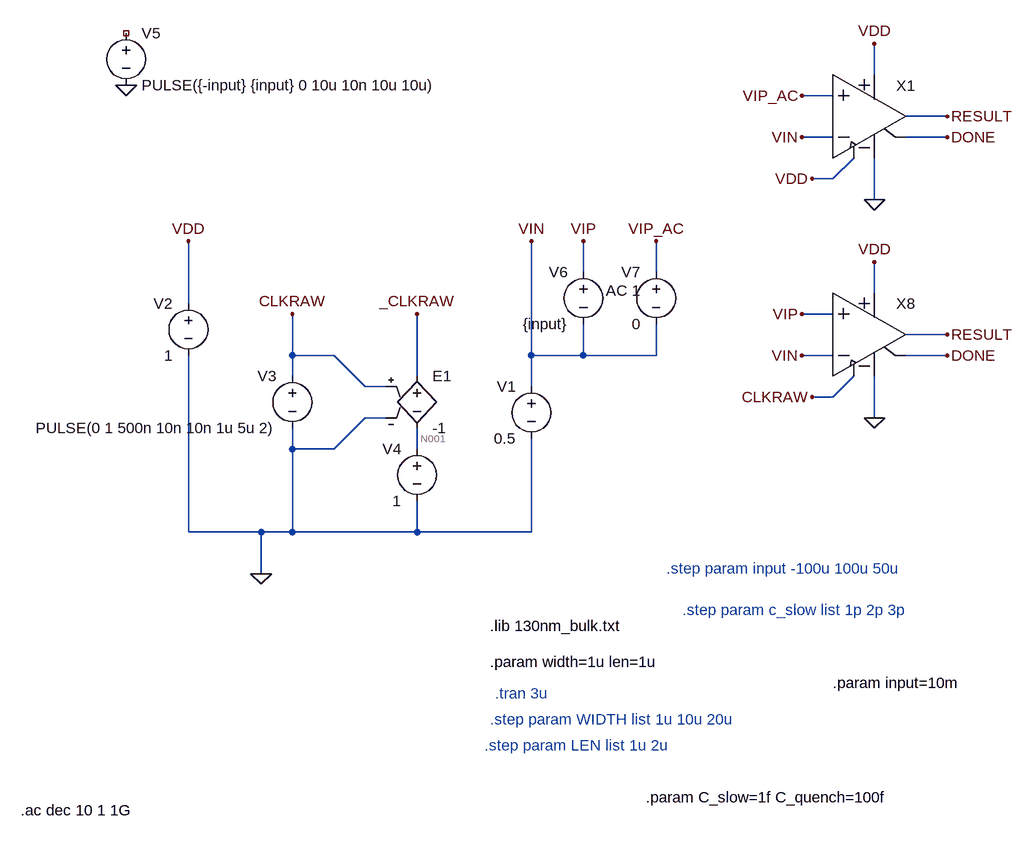
[diagram p0: schematic tb_comparator.asc]
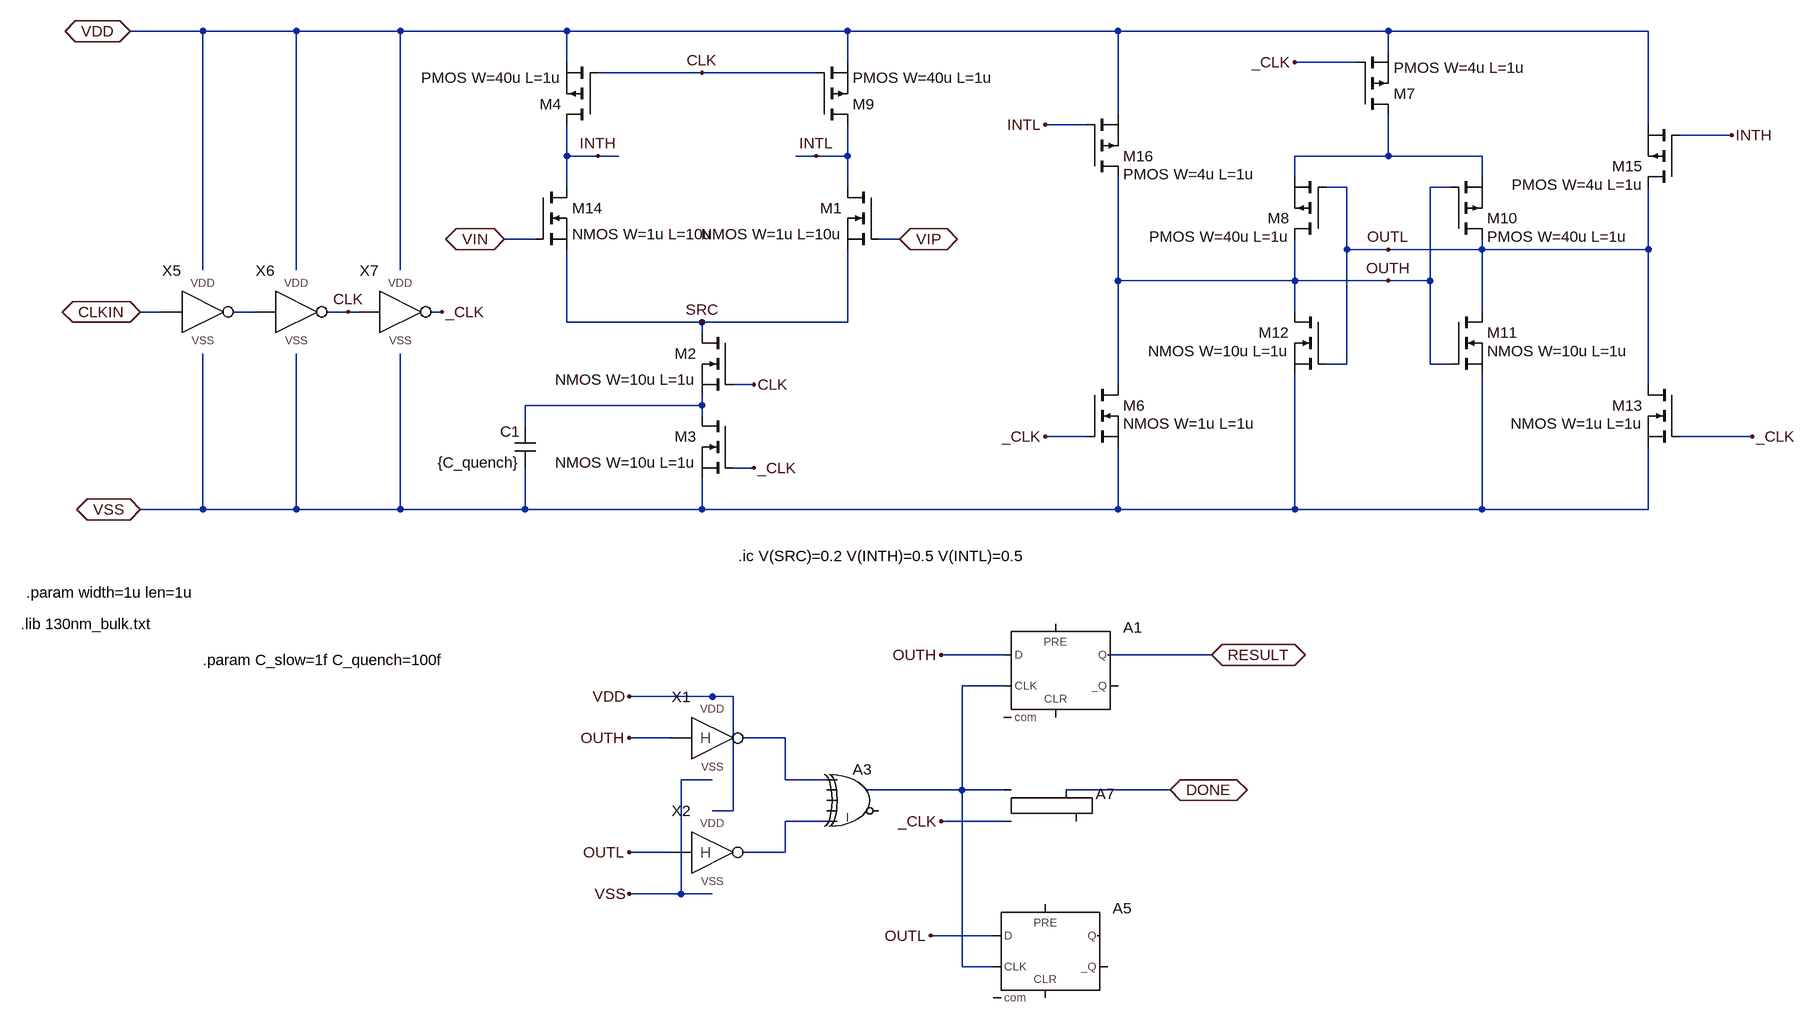
[diagram p1: sub-circuit dyn_comparator.asc]
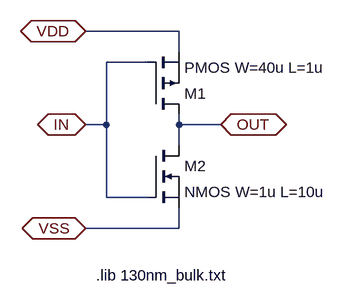
[diagram p2: sub-circuit skewh_inverter.asc]
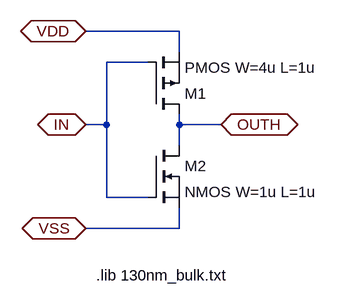
[diagram p3: sub-circuit skewm_inverter.asc]
tb_comparator.asc, the LTspice schematic file:
Version 4
SHEET 1 1376 1188
WIRE -352 -656 -352 -704
WIRE -416 -624 -464 -624
WIRE -240 -592 -304 -592
WIRE -416 -560 -464 -560
WIRE -240 -560 -304 -560
WIRE -416 -496 -384 -528
WIRE -416 -496 -448 -496
WIRE -352 -464 -352 -528
WIRE -800 -352 -800 -400
WIRE -688 -352 -688 -400
WIRE -352 -320 -352 -368
WIRE -1408 -304 -1408 -400
WIRE -416 -288 -464 -288
WIRE -240 -256 -304 -256
WIRE -1248 -224 -1248 -288
WIRE -1184 -224 -1248 -224
WIRE -880 -224 -880 -400
WIRE -800 -224 -800 -272
WIRE -800 -224 -880 -224
WIRE -688 -224 -688 -272
WIRE -688 -224 -800 -224
WIRE -416 -224 -464 -224
WIRE -240 -224 -304 -224
WIRE -1248 -192 -1248 -224
WIRE -1056 -192 -1056 -288
WIRE -1136 -176 -1184 -224
WIRE -1104 -176 -1136 -176
WIRE -880 -176 -880 -224
WIRE -416 -160 -384 -192
WIRE -416 -160 -448 -160
WIRE -1104 -128 -1136 -128
WIRE -352 -128 -352 -192
WIRE -1248 -80 -1248 -112
WIRE -1184 -80 -1136 -128
WIRE -1184 -80 -1248 -80
WIRE -1056 -80 -1056 -112
WIRE -1408 48 -1408 -224
WIRE -1296 48 -1408 48
WIRE -1248 48 -1248 -80
WIRE -1248 48 -1296 48
WIRE -1056 48 -1056 0
WIRE -1056 48 -1248 48
WIRE -880 48 -880 -96
WIRE -880 48 -1056 48
WIRE -1296 112 -1296 48
FLAG -352 -368 VDD
FLAG -464 -224 VIN
FLAG -1296 112 0
FLAG -880 -400 VIN
FLAG -1408 -400 VDD
FLAG -464 -288 VIP
FLAG -1248 -288 CLKRAW
FLAG -1056 -288 _CLKRAW
FLAG -800 -400 VIP
FLAG -1504 -640 0
FLAG -448 -160 CLKRAW
FLAG -352 -128 0
FLAG -240 -256 RESULT
FLAG -240 -224 DONE
FLAG -352 -704 VDD
FLAG -464 -560 VIN
FLAG -464 -624 VIP_AC
FLAG -448 -496 VDD
FLAG -352 -464 0
FLAG -240 -592 RESULT
FLAG -240 -560 DONE
FLAG -688 -400 VIP_AC
SYMBOL voltage -880 -192 M0
WINDOW 123 0 0 Left 0
WINDOW 39 0 0 Left 0
SYMATTR InstName V1
SYMATTR Value 0.5
SYMBOL voltage -1408 -320 M0
WINDOW 123 0 0 Left 0
WINDOW 39 0 0 Left 0
SYMATTR InstName V2
SYMATTR Value 1
SYMBOL voltage -1248 -208 M0
WINDOW 123 0 0 Left 0
WINDOW 39 0 0 Left 0
SYMATTR InstName V3
SYMATTR Value PULSE(0 1 500n 10n 10n 1u 5u 2)
SYMBOL e -1056 -208 R0
SYMATTR InstName E1
SYMATTR Value -1
SYMBOL voltage -1056 -96 M0
WINDOW 123 0 0 Left 0
WINDOW 39 0 0 Left 0
SYMATTR InstName V4
SYMATTR Value 1
SYMBOL voltage -1504 -736 R0
WINDOW 123 0 0 Left 0
WINDOW 39 0 0 Left 0
SYMATTR InstName V5
SYMATTR Value PULSE({-input} {input} 0 10u 10n 10u 10u)
SYMBOL voltage -800 -368 M0
WINDOW 123 0 0 Left 0
WINDOW 39 0 0 Left 0
SYMATTR InstName V6
SYMATTR Value {input}
SYMBOL dyn_comparator -368 -256 R0
SYMATTR InstName X8
SYMBOL dyn_comparator -368 -592 R0
SYMATTR InstName X1
SYMBOL voltage -688 -368 M0
WINDOW 123 24 44 Left 2
WINDOW 39 0 0 Left 0
SYMATTR Value2 AC 1
SYMATTR InstName V7
SYMATTR Value 0
TEXT -944 192 Left 2 !.lib 130nm_bulk.txt
TEXT -936 296 Left 2 ;.tran 3u
TEXT -944 248 Left 2 !.param width=1u len=1u
TEXT -944 336 Left 2 ;.step param WIDTH list 1u 10u 20u
TEXT -952 376 Left 2 ;.step param LEN list 1u 2u
TEXT -416 280 Left 2 !.param input=10m
TEXT -672 104 Left 2 ;.step param input -100u 100u 50u
TEXT -648 168 Left 2 ;.step param c_slow list 1p 2p 3p
TEXT -704 456 Left 2 !.param C_slow=1f C_quench=100f
TEXT -1666 476 Left 2 !.ac dec 10 1 1G

dyn_comparator.asc, the sub-circuit schematic file:
Version 4
SHEET 1 3000 1348
WIRE -368 -352 -480 -352
WIRE -224 -352 -368 -352
WIRE -64 -352 -224 -352
WIRE 192 -352 -64 -352
WIRE 624 -352 192 -352
WIRE 1040 -352 624 -352
WIRE 1456 -352 1040 -352
WIRE 1856 -352 1456 -352
WIRE 1456 -320 1456 -352
WIRE 192 -304 192 -352
WIRE 624 -304 624 -352
WIRE 1408 -304 1312 -304
WIRE 400 -288 240 -288
WIRE 576 -288 400 -288
WIRE 1040 -224 1040 -352
WIRE 992 -208 928 -208
WIRE 1856 -208 1856 -352
WIRE 1984 -192 1904 -192
WIRE 192 -160 192 -208
WIRE 240 -160 192 -160
WIRE 272 -160 240 -160
WIRE 576 -160 544 -160
WIRE 624 -160 624 -208
WIRE 624 -160 576 -160
WIRE 1456 -160 1456 -224
WIRE 1456 -160 1312 -160
WIRE 1600 -160 1456 -160
WIRE 1312 -128 1312 -160
WIRE 1600 -128 1600 -160
WIRE 192 -112 192 -160
WIRE 624 -112 624 -160
WIRE 1392 -112 1360 -112
WIRE 1552 -112 1520 -112
WIRE 144 -32 96 -32
WIRE 704 -32 672 -32
WIRE 1392 -16 1392 -112
WIRE 1456 -16 1392 -16
WIRE 1600 -16 1600 -32
WIRE 1600 -16 1456 -16
WIRE 1856 -16 1856 -112
WIRE 1856 -16 1600 -16
WIRE -368 16 -368 -352
WIRE -224 16 -224 -352
WIRE -64 16 -64 -352
WIRE 1040 32 1040 -128
WIRE 1312 32 1312 -32
WIRE 1312 32 1040 32
WIRE 1456 32 1312 32
WIRE 1520 32 1520 -112
WIRE 1520 32 1456 32
WIRE -432 80 -464 80
WIRE -288 80 -320 80
WIRE -144 80 -176 80
WIRE -128 80 -144 80
WIRE 0 80 -16 80
WIRE 1312 80 1312 32
WIRE 1600 80 1600 -16
WIRE 192 96 192 -16
WIRE 400 96 192 96
WIRE 624 96 624 -16
WIRE 624 96 400 96
WIRE 400 112 400 96
WIRE 1392 160 1392 -16
WIRE 1392 160 1360 160
WIRE 1520 160 1520 32
WIRE 1552 160 1520 160
WIRE 480 192 448 192
WIRE 1040 192 1040 32
WIRE 1856 192 1856 -16
WIRE 400 224 400 208
WIRE 400 224 128 224
WIRE 400 240 400 224
WIRE 128 256 128 224
WIRE 992 272 928 272
WIRE 2016 272 1904 272
WIRE 480 320 448 320
WIRE -368 384 -368 144
WIRE -368 384 -464 384
WIRE -224 384 -224 144
WIRE -224 384 -368 384
WIRE -64 384 -64 144
WIRE -64 384 -224 384
WIRE 128 384 128 320
WIRE 128 384 -64 384
WIRE 400 384 400 336
WIRE 400 384 128 384
WIRE 1040 384 1040 288
WIRE 1040 384 400 384
WIRE 1312 384 1312 176
WIRE 1312 384 1040 384
WIRE 1600 384 1600 176
WIRE 1600 384 1312 384
WIRE 1856 384 1856 288
WIRE 1856 384 1600 384
WIRE 864 608 768 608
WIRE 1184 608 1024 608
WIRE 864 656 800 656
WIRE 416 672 288 672
WIRE 448 672 416 672
WIRE 352 736 288 736
WIRE 528 736 464 736
WIRE 416 800 368 800
WIRE 528 800 528 736
WIRE 592 800 528 800
WIRE 800 816 800 656
WIRE 800 816 656 816
WIRE 864 816 800 816
WIRE 1120 816 960 816
WIRE 448 848 448 672
WIRE 448 848 416 848
WIRE 592 864 528 864
WIRE 864 864 768 864
WIRE 352 912 288 912
WIRE 528 912 528 864
WIRE 528 912 464 912
WIRE 368 976 368 800
WIRE 368 976 288 976
WIRE 416 976 368 976
WIRE 848 1040 752 1040
WIRE 800 1088 800 816
WIRE 848 1088 800 1088
FLAG 240 -160 INTH
FLAG 96 -32 VIN
IOPIN 96 -32 BiDir
FLAG 576 -160 INTL
FLAG 704 -32 VIP
IOPIN 704 -32 BiDir
FLAG 480 192 CLK
FLAG 400 -288 CLK
FLAG 928 -208 INTL
FLAG 2016 272 _CLK
FLAG 1984 -192 INTH
FLAG 1456 -16 OUTL
FLAG 1456 32 OUTH
FLAG 768 608 OUTH
FLAG 1184 608 RESULT
IOPIN 1184 608 BiDir
FLAG 768 864 _CLK
FLAG 288 736 OUTH
FLAG 1120 816 DONE
IOPIN 1120 816 BiDir
FLAG 288 912 OUTL
FLAG 288 672 VDD
FLAG 928 272 _CLK
FLAG 1312 -304 _CLK
FLAG -464 80 CLKIN
IOPIN -464 80 BiDir
FLAG -144 80 CLK
FLAG 752 1040 OUTL
FLAG 0 80 _CLK
FLAG 480 320 _CLK
FLAG -464 384 VSS
IOPIN -464 384 BiDir
FLAG -480 -352 VDD
IOPIN -480 -352 BiDir
FLAG 288 976 VSS
FLAG 400 96 SRC
SYMBOL pmos 240 -208 R180
SYMATTR InstName M4
SYMATTR Value PMOS W=40u L=1u
SYMBOL nmos 448 112 M0
SYMATTR InstName M2
SYMATTR Value NMOS W=10u L=1u
SYMBOL pmos 1360 -32 R180
WINDOW 3 56 4 Left 2
SYMATTR Value PMOS W=40u L=1u
SYMATTR InstName M8
SYMBOL pmos 1552 -32 M180
WINDOW 3 56 4 Left 2
SYMATTR Value PMOS W=40u L=1u
SYMATTR InstName M10
SYMBOL nmos 1552 80 R0
WINDOW 3 56 60 Left 2
SYMATTR Value NMOS W=10u L=1u
SYMATTR InstName M11
SYMBOL nmos 1360 80 M0
WINDOW 3 56 60 Left 2
SYMATTR Value NMOS W=10u L=1u
SYMATTR InstName M12
SYMBOL nmos 1904 192 M0
WINDOW 3 56 60 Left 2
SYMATTR Value NMOS W=1u L=1u
SYMATTR InstName M13
SYMBOL pmos 1904 -112 R180
WINDOW 3 56 4 Left 2
SYMATTR Value PMOS W=4u L=1u
SYMATTR InstName M15
SYMBOL pmos 992 -128 M180
WINDOW 3 56 4 Left 2
SYMATTR Value PMOS W=4u L=1u
SYMATTR InstName M16
SYMBOL Digital\\dflop 944 560 R0
SYMATTR InstName A1
SYMBOL Digital\\xor 640 768 R0
SYMATTR InstName A3
SYMBOL nmos 992 192 R0
WINDOW 3 56 60 Left 2
SYMATTR Value NMOS W=1u L=1u
SYMATTR InstName M6
SYMBOL pmos 1408 -224 M180
SYMATTR InstName M7
SYMATTR Value PMOS W=4u L=1u
SYMBOL skewH_inverter 416 720 R0
SYMATTR InstName X1
SYMBOL skewH_inverter 416 896 R0
SYMATTR InstName X2
SYMBOL Digital\\srflop 912 768 R0
SYMATTR InstName A7
SYMBOL pmos 576 -208 M180
SYMATTR InstName M9
SYMATTR Value PMOS W=40u L=1u
SYMBOL nmos 144 -112 R0
SYMATTR InstName M14
SYMATTR Value NMOS W=1u L=10u
SYMBOL nmos 672 -112 M0
SYMATTR InstName M1
SYMATTR Value NMOS W=1u L=10u
SYMBOL skewM_inverter -368 64 R0
SYMATTR InstName X5
SYMBOL skewM_inverter -224 64 R0
SYMATTR InstName X6
SYMBOL Digital\\dflop 928 992 R0
SYMATTR InstName A5
SYMBOL skewM_inverter -64 64 R0
SYMATTR InstName X7
SYMBOL cap 144 256 M0
SYMATTR InstName C1
SYMATTR Value {C_quench}
SYMBOL nmos 448 240 M0
SYMATTR InstName M3
SYMATTR Value NMOS W=10u L=1u
TEXT -648 560 Left 2 !.lib 130nm_bulk.txt
TEXT -640 512 Left 2 !.param width=1u len=1u
TEXT -368 616 Left 2 !.param C_slow=1f C_quench=100f
TEXT 456 456 Left 2 !.ic V(SRC)=0.2 V(INTH)=0.5 V(INTL)=0.5

skewh_inverter.asc, the sub-circuit schematic file:
Version 4
SHEET 1 880 680
WIRE 128 -48 -16 -48
WIRE 128 -16 128 -48
WIRE 80 0 16 0
WIRE 16 96 16 0
WIRE 16 96 -16 96
WIRE 128 96 128 80
WIRE 192 96 128 96
WIRE 128 128 128 96
WIRE 16 208 16 96
WIRE 80 208 16 208
WIRE 128 256 128 224
WIRE 128 256 -16 256
FLAG 192 96 OUT
IOPIN 192 96 BiDir
FLAG -16 -48 VDD
IOPIN -16 -48 BiDir
FLAG -16 96 IN
IOPIN -16 96 BiDir
FLAG -16 256 VSS
IOPIN -16 256 BiDir
SYMBOL pmos 80 80 M180
SYMATTR InstName M1
SYMATTR Value PMOS W=40u L=1u
SYMBOL nmos 80 128 R0
SYMATTR InstName M2
SYMATTR Value NMOS W=1u L=10u
TEXT 0 328 Left 2 !.lib 130nm_bulk.txt

skewm_inverter.asc, the sub-circuit schematic file:
Version 4
SHEET 1 880 980
WIRE 320 -128 176 -128
WIRE 320 -96 320 -128
WIRE 272 -80 208 -80
WIRE 208 16 208 -80
WIRE 208 16 176 16
WIRE 320 16 320 0
WIRE 384 16 320 16
WIRE 320 48 320 16
WIRE 208 128 208 16
WIRE 272 128 208 128
WIRE 320 176 320 144
WIRE 320 176 176 176
FLAG 384 16 OUTH
IOPIN 384 16 BiDir
FLAG 176 -128 VDD
IOPIN 176 -128 BiDir
FLAG 176 16 IN
IOPIN 176 16 BiDir
FLAG 176 176 VSS
IOPIN 176 176 BiDir
SYMBOL pmos 272 0 M180
SYMATTR InstName M1
SYMATTR Value PMOS W=4u L=1u
SYMBOL nmos 272 48 R0
SYMATTR InstName M2
SYMATTR Value NMOS W=1u L=1u
TEXT 192 248 Left 2 !.lib 130nm_bulk.txt

The netlist it stands for:
* tb_comparator.asc
V1 VIN 0 0.5
V2 VDD 0 1
V3 CLKRAW 0 PULSE(0 1 500n 10n 10n 1u 5u 2)
E1 _CLKRAW N001 CLKRAW 0 -1
V4 N001 0 1
V5 NC_01 0 PULSE({-input} {input} 0 10u 10n 10u 10u)
V6 VIP VIN {input}
XX8 CLKRAW RESULT VDD VIN VIP 0 DONE dyn_comparator
XX1 VDD RESULT VDD VIN VIP_AC 0 DONE dyn_comparator
V7 VIP_AC VIN 0 AC 1

* block symbol definitions
.subckt dyn_comparator CLKIN RESULT VDD VIN VIP VSS DONE
M4 INTH CLK VDD VDD PMOS W=40u L=1u
M2 SRC CLK N003 N003 NMOS W=10u L=1u
M8 OUTH OUTL N001 N001 PMOS W=40u L=1u
M10 OUTL OUTH N001 N001 PMOS W=40u L=1u
M11 OUTL OUTH VSS VSS NMOS W=10u L=1u
M12 OUTH OUTL VSS VSS NMOS W=10u L=1u
M13 OUTL _CLK VSS VSS NMOS W=1u L=1u
M15 OUTL INTH VDD VDD PMOS W=4u L=1u
M16 OUTH INTL VDD VDD PMOS W=4u L=1u
A1 OUTH 0 N004 0 0 0 RESULT 0 DFLOP
A3 N005 0 0 0 N006 0 N004 0 XOR
M6 OUTH _CLK VSS VSS NMOS W=1u L=1u
M7 N001 _CLK VDD VDD PMOS W=4u L=1u
XX1 OUTH N005 VDD VSS skewh_inverter
XX2 OUTL N006 VDD VSS skewh_inverter
A7 N004 _CLK 0 0 0 0 DONE 0 SRFLOP
M9 INTL CLK VDD VDD PMOS W=40u L=1u
M14 INTH VIN SRC SRC NMOS W=1u L=10u
M1 INTL VIP SRC SRC NMOS W=1u L=10u
XX5 CLKIN N002 VDD VSS skewm_inverter
XX6 N002 CLK VDD VSS skewm_inverter
A5 OUTL 0 N004 0 0 0 0 0 DFLOP
XX7 CLK _CLK VDD VSS skewm_inverter
C1 N003 VSS {C_quench}
M3 N003 _CLK VSS VSS NMOS W=10u L=1u
.lib 130nm_bulk.txt
.param width=1u len=1u
.param C_slow=1f C_quench=100f
.ic V(SRC)=0.2 V(INTH)=0.5 V(INTL)=0.5
.ends dyn_comparator

.subckt skewh_inverter IN OUT VDD VSS
M1 OUT IN VDD VDD PMOS W=40u L=1u
M2 OUT IN VSS VSS NMOS W=1u L=10u
.lib 130nm_bulk.txt
.ends skewh_inverter

.subckt skewm_inverter IN OUTH VDD VSS
M1 OUTH IN VDD VDD PMOS W=4u L=1u
M2 OUTH IN VSS VSS NMOS W=1u L=1u
.lib 130nm_bulk.txt
.ends skewm_inverter

.model NMOS NMOS
.model PMOS PMOS
.lib standard.mos
.lib 130nm_bulk.txt
* .tran 3u
.param width=1u len=1u
* .step param WIDTH list 1u 10u 20u
* .step param LEN list 1u 2u
.param input=10m
* .step param input -100u 100u 50u
* .step param c_slow list 1p 2p 3p
.param C_slow=1f C_quench=100f
.ac dec 10 1 1G
.backanno
.end

* Results of the author's LTspice run, read from the files saved beside the schematic
* Operating Point, zero values left out:
*   V(vin) = 500 mV
*   V(vdd) = 1 V
*   V(_clkraw) = 1 V
*   V(n001) = 1 V
*   V(vip) = 510 mV
*   V(vip_ac) = 500 mV
*   I(V7) = -4.225 pA
*   I(V6) = -6.182 pA
*   I(V3) = 203.2 pA
*   I(V2) = -1.212 mA
*   I(V1) = -18.86 pA
*   Ix(x8:CLKIN) = -203.2 pA
*   Ix(x8:VDD) = 1.167 mA
*   Ix(x8:VIN) = 4.225 pA
*   Ix(x8:VIP) = 6.182 pA
*   Ix(x8:VSS) = -12.81 µA
*   Ix(x1:CLKIN) = 9.896 nA
*   Ix(x1:VDD) = 45.19 µA
*   Ix(x1:VIN) = 4.225 pA
*   Ix(x1:VIP) = 4.225 pA
*   Ix(x1:VSS) = -45.18 µA